# EAGLE design main (EAGLE 6.6.0)
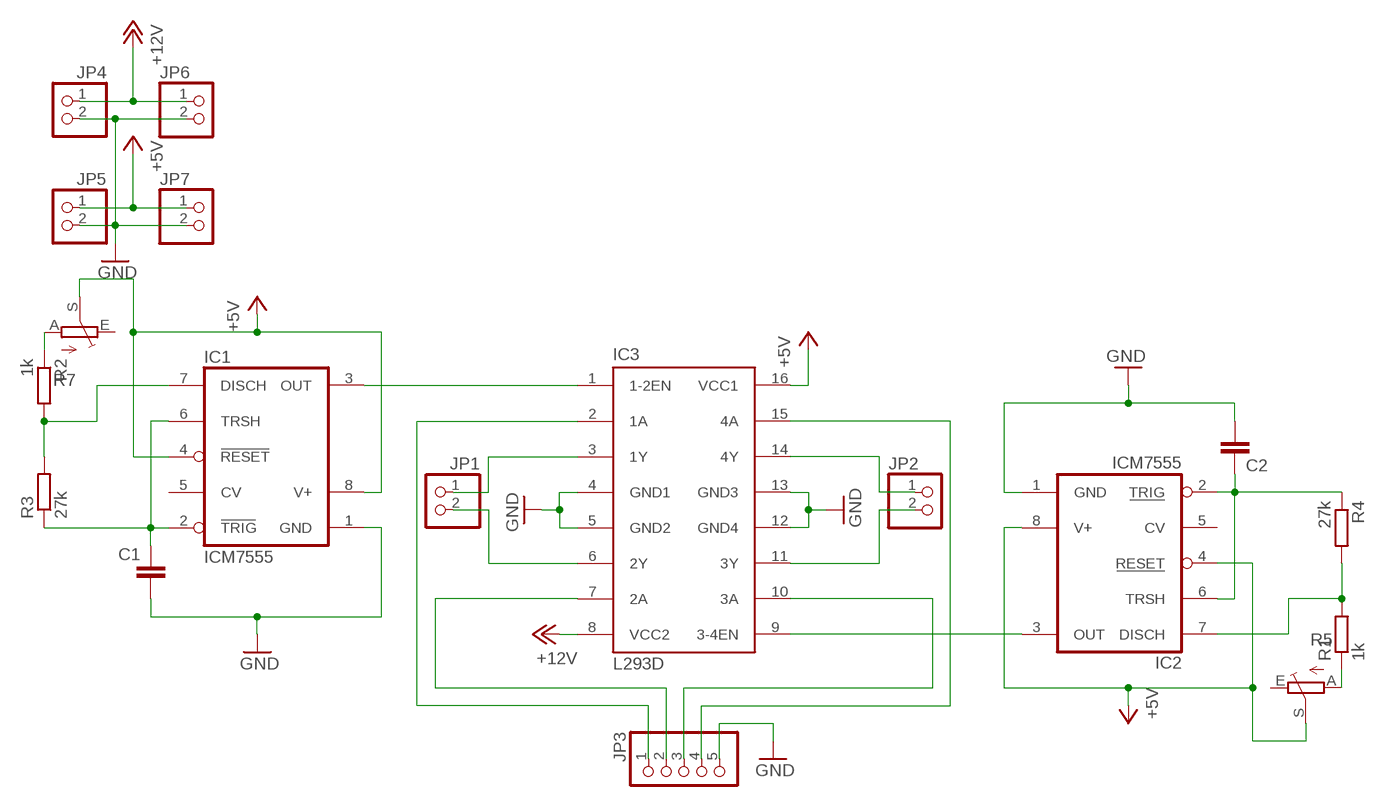
[diagram p0: schematic, sheet 1]

## Parts
C1  C-EU025-025X050  [C025-025X050]
C2  C-EU025-025X050  [C025-025X050]
IC1  ICM7555  [DIL08]
IC2  ICM7555  [DIL08]
IC3  L293D  [DIL16]
JP1  PINHD-1X2  [1X02]
JP2  PINHD-1X2  [1X02]
JP3  PINHD-1X5  [1X05]
JP4  PINHD-1X2  [1X02]
JP5  PINHD-1X2  [1X02]
JP6  PINHD-1X2  [1X02]
JP7  PINHD-1X2  [1X02]
R1  1k  R-EU_0204/7  [0204/7]
R2  1k  R-EU_0204/7  [0204/7]
R3  27k  R-EU_0204/7  [0204/7]
R4  27k  R-EU_0204/7  [0204/7]
R5  TRIM_EU-LI15  [LI15]
R7  TRIM_EU-LI15  [LI15]

## Nets
+5V: IC1.4(RESET) IC1.8(V+) IC2.4(RESET) IC2.8(V+) IC3.16(VCC1) JP5.1 JP7.1 R5.S R7.S
+12V: IC3.8(VCC2) JP4.1 JP6.1
GND: C1.2 C2.2 IC1.1(GND) IC2.1(GND) IC3.4(GND1) IC3.5(GND2) IC3.12(GND4) IC3.13(GND3) JP3.5 JP4.2 JP5.2 JP6.2 JP7.2
N$1: IC3.15(4A) JP3.4
N$2: IC3.3(1Y) JP1.1
N$3: IC3.6(2Y) JP1.2
N$4: IC3.11(3Y) JP2.2
N$5: IC3.14(4Y) JP2.1
N$6: IC3.2(1A) JP3.1
N$7: IC3.7(2A) JP3.2
N$8: IC3.10(3A) JP3.3
N$9: C2.1 IC2.2(TRIG) IC2.6(TRSH) R4.1
N$10: C1.1 IC1.2(TRIG) IC1.6(TRSH) R3.1
N$11: IC2.7(DISCH) R1.2 R4.2
N$12: R1.1 R5.A
N$13: IC2.3(OUT) IC3.9(3-4EN)
N$14: IC1.7(DISCH) R2.2 R3.2
N$15: IC1.3(OUT) IC3.1(1-2EN)
N$16: R2.1 R7.A
Unconnected: IC1.5(CV) IC2.5(CV) R5.E R7.E

## Library data of the parts
C1 C2 = rcl:C-EU: CAPACITOR, European symbol
IC1 IC2 = maxim:ICM7555: TIMER; MF: MAXIM; MPN: ICM7555IPA+; OC_FARNELL: 9663762; OC_NEWARK: 68K4387
IC3 = st-microelectronics:L293D: PUSH-PULL 4 CHANNEL DRIVER; MPN: L293D; OC_FARNELL: 9589619; OC_NEWARK: 56P8249
JP1 JP2 JP4-JP7 = pinhead:PINHD-1X2: PIN HEADER
JP3 = pinhead:PINHD-1X5: PIN HEADER
R1-R4 = rcl:R-EU_: RESISTOR, European symbol
R5 R7 = pot:TRIM_EU-: POTENTIOMETER

## Board
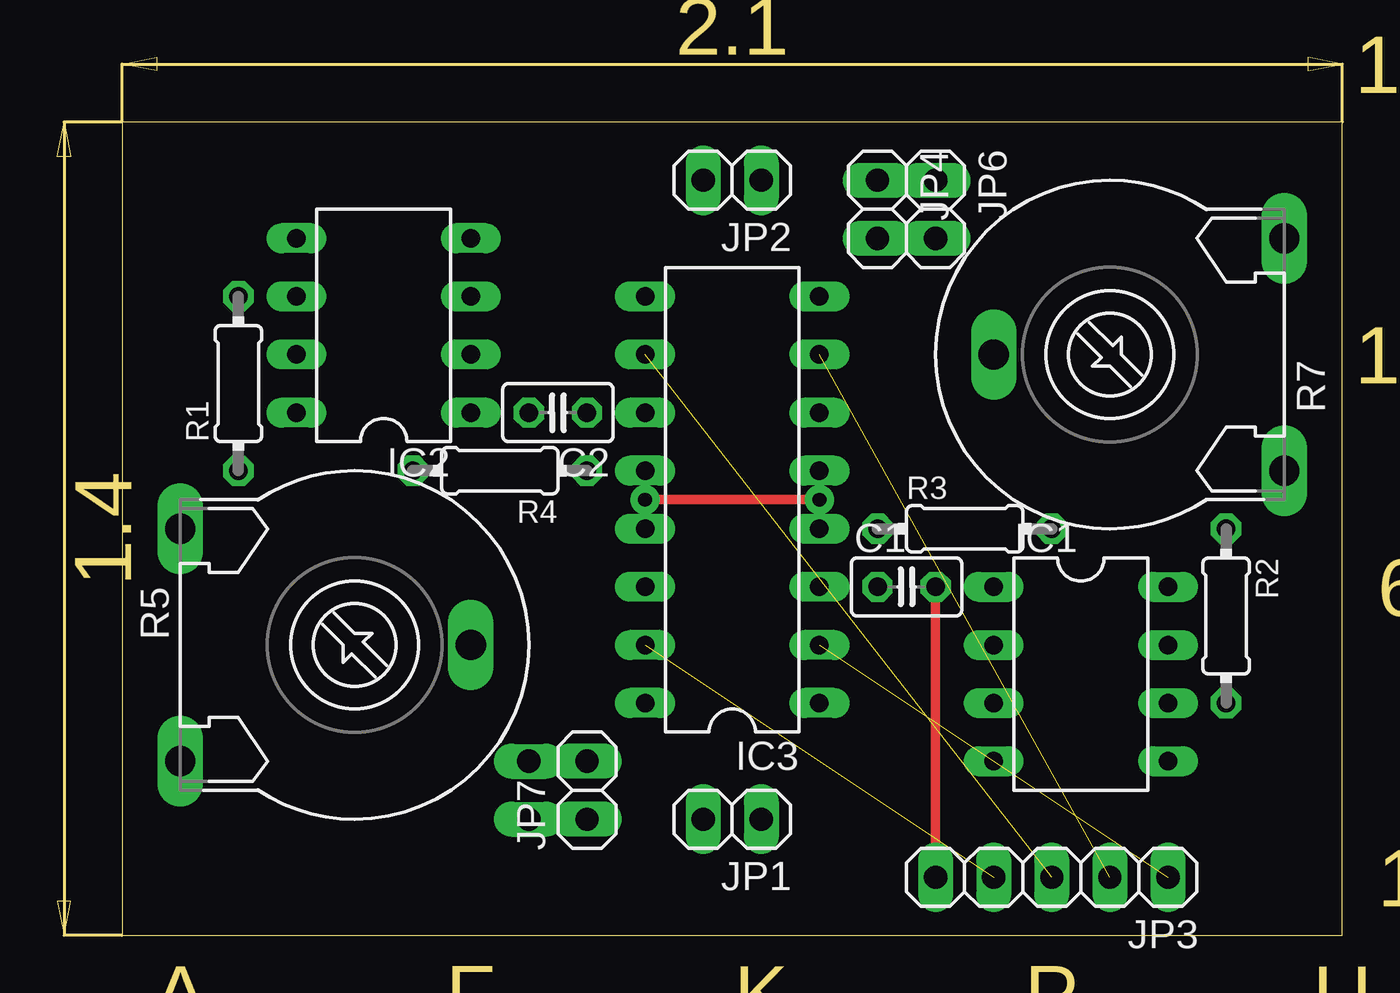
[diagram p1: board, top side]
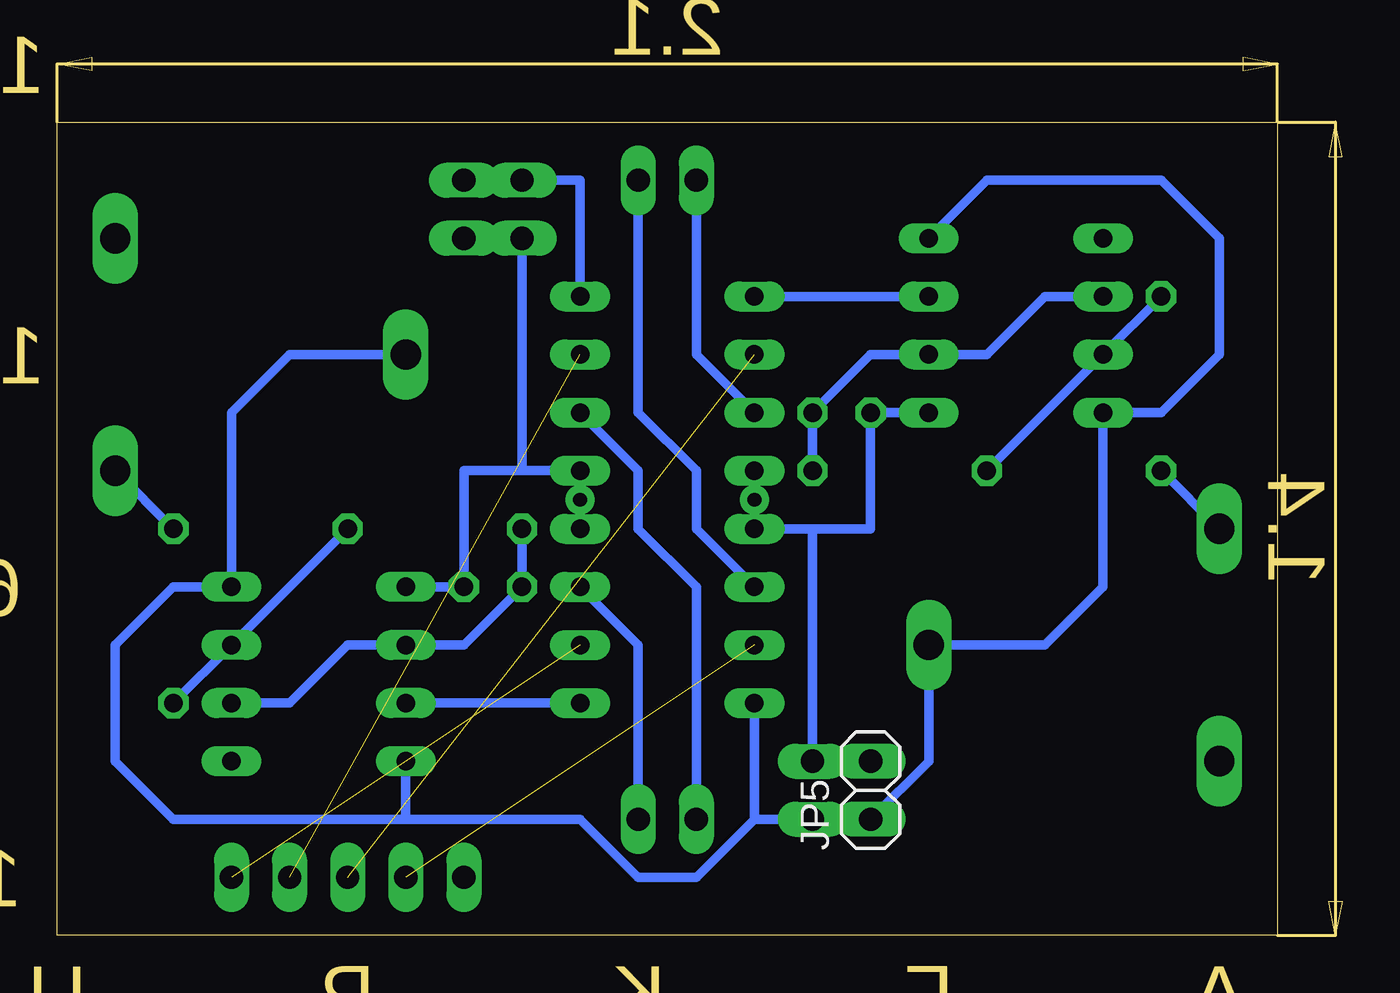
[diagram p2: board, bottom side, seen from below]

Size 53.34 x 35.56 mm. Coordinates in mm from the lower left corner, seen from the top.
Outline: 0,0 53.34,0 53.34,35.56 0,35.56 0,0
Copper layers (1*16): Top 0.035mm / dielectric 1.5mm / Bottom 0.035mm
Design rules "default": minimum track width 10mil, minimum drill 24mil, track to track 8mil, track to pad 8mil, pad to pad 8mil, via to via 8mil, smd to smd 8mil, copper to edge 40mil, drill to drill 8mil, minimum pad ring 10mil, minimum via ring 8mil, stop-mask expansion 4mil, vias tented up to drill 0mil, thermal gap 10mil

### Footprints (pad centres in the part's own frame; a part is rotated, then mirrored left to right if it is on the bottom)
C025-025X050 = drill 0.813 octagon: 1 -1.27,0; 2 1.27,0
DIL08 = drill 0.813 long: 1 -3.81,-3.81; 2 -1.27,-3.81; 3 1.27,-3.81; 4 3.81,-3.81; 5 3.81,3.81; 6 1.27,3.81; 7 -1.27,3.81; 8 -3.81,3.81
DIL16 = drill 0.813 long: 1 -8.89,-3.81; 2 -6.35,-3.81; 3 -3.81,-3.81; 4 -1.27,-3.81; 5 1.27,-3.81; 6 3.81,-3.81; 7 6.35,-3.81; 8 8.89,-3.81; 9 8.89,3.81; 10 6.35,3.81; 11 3.81,3.81; 12 1.27,3.81; 13 -1.27,3.81; 14 -3.81,3.81; 15 -6.35,3.81; 16 -8.89,3.81
1X02 = drill 1.016 long: 1 -1.27,0; 2 1.27,0
1X05 = drill 1.016 long: 1 -5.08,0; 2 -2.54,0; 3 0,0; 4 2.54,0; 5 5.08,0
0204/7 = drill 0.813 octagon: 1 -3.81,0; 2 3.81,0
LI15 = drill 1.321 long: A -5.08,-7.62; E 5.08,-7.62; S 0,5.08

### Placement (x,y rotation side)
C1  34.29,15.24 0 top
C2  19.05,22.86 180 top
IC1  41.91,11.43 270 top
IC2  11.43,26.67 90 top
IC3  26.67,19.05 90 top
JP1  26.67,5.08 180 top
JP2  26.67,33.02 180 top
JP3  40.64,2.54 180 top
JP4  33.02,31.75 270 top
JP5  17.78,6.35 90 bottom
JP6  35.56,31.75 270 top
JP7  20.32,6.35 90 top
R1  5.08,24.13 90 top
R2  48.26,13.97 270 top
R3  36.83,17.78 0 top
R4  16.51,20.32 180 top
R5  10.16,12.7 270 top
R7  43.18,25.4 90 top

### Tracks (layer width: path | path; a pad name or v marks a point on that pad's centre or on a via)
+5V
  Bottom 0.406: R7.S 43.18,25.4 45.72,22.86 IC1.8 48.26,15.24 50.8,12.7 50.8,7.62 48.26,5.08 38.1,5.08 | IC2.4 12.7,33.02 5.08,33.02 2.54,30.48 2.54,25.4 5.08,22.86 IC2.8 7.62,15.24 10.16,12.7 R5.S 15.24,7.62 JP5.1 JP7.1 22.86,5.08 | IC1.4 38.1,5.08 | 38.1,5.08 30.48,5.08 27.94,2.54 25.4,2.54 22.86,5.08 | 22.86,5.08 IC3.16
+12V
  Bottom 0.406: IC3.8 30.48,33.02 JP4.1 JP6.1
GND  (via drill 0.6 pad 1.27)
  Top 0.406: v22.86,19.05 v30.48,19.05 | JP3.5 C1.2
  Bottom 0.406: IC2.1 C2.2 17.78,17.78 20.32,17.78 | 20.32,17.78 IC3.13 v22.86,19.05 IC3.12 | IC1.1 C1.2 35.56,20.32 33.02,20.32 | 33.02,20.32 IC3.5 v30.48,19.05 IC3.4 | JP5.2 JP7.2 20.32,17.78 | JP6.2 JP4.2 33.02,20.32
N$1  (1 unrouted)
N$2
  Bottom 0.406: JP1.1 27.94,12.7 IC3.3
N$3
  Bottom 0.406: IC3.6 27.94,20.32 27.94,17.78 25.4,15.24 JP1.2
N$4
  Bottom 0.406: IC3.11 25.4,25.4 JP2.2
N$5
  Bottom 0.406: IC3.14 25.4,17.78 25.4,20.32 27.94,22.86 JP2.1
N$6  (1 unrouted)
N$7  (1 unrouted)
N$8  (1 unrouted)
N$9
  Bottom 0.406: IC2.6 10.16,27.94 12.7,25.4 IC2.2 17.78,25.4 C2.1 R4.1
N$10
  Bottom 0.406: R3.1 C1.1 35.56,12.7 IC1.2 40.64,12.7 43.18,10.16 IC1.6
N$11
  Bottom 0.406: R4.2 IC2.7 R1.2
N$12
  Bottom 0.406: R1.1 R5.A
N$13
  Bottom 0.406: IC2.3 IC3.9
N$14
  Bottom 0.406: R3.2 IC1.7 R2.2
N$15
  Bottom 0.406: IC1.3 IC3.1
N$16
  Bottom 0.406: R2.1 R7.A

### Text on the board
Dimension: 15 | 10 | 6 | 1 | A | F | K | P | U